# EasyEDA schematic PHOTOPOLYMER_CURE_LIGHT_V0_0.json
TITLE: Sheet_1; REV: 1.0; Date: 2023-11-01; Sheet: 1/1; Drawn By: AmirB; Company: Your Company
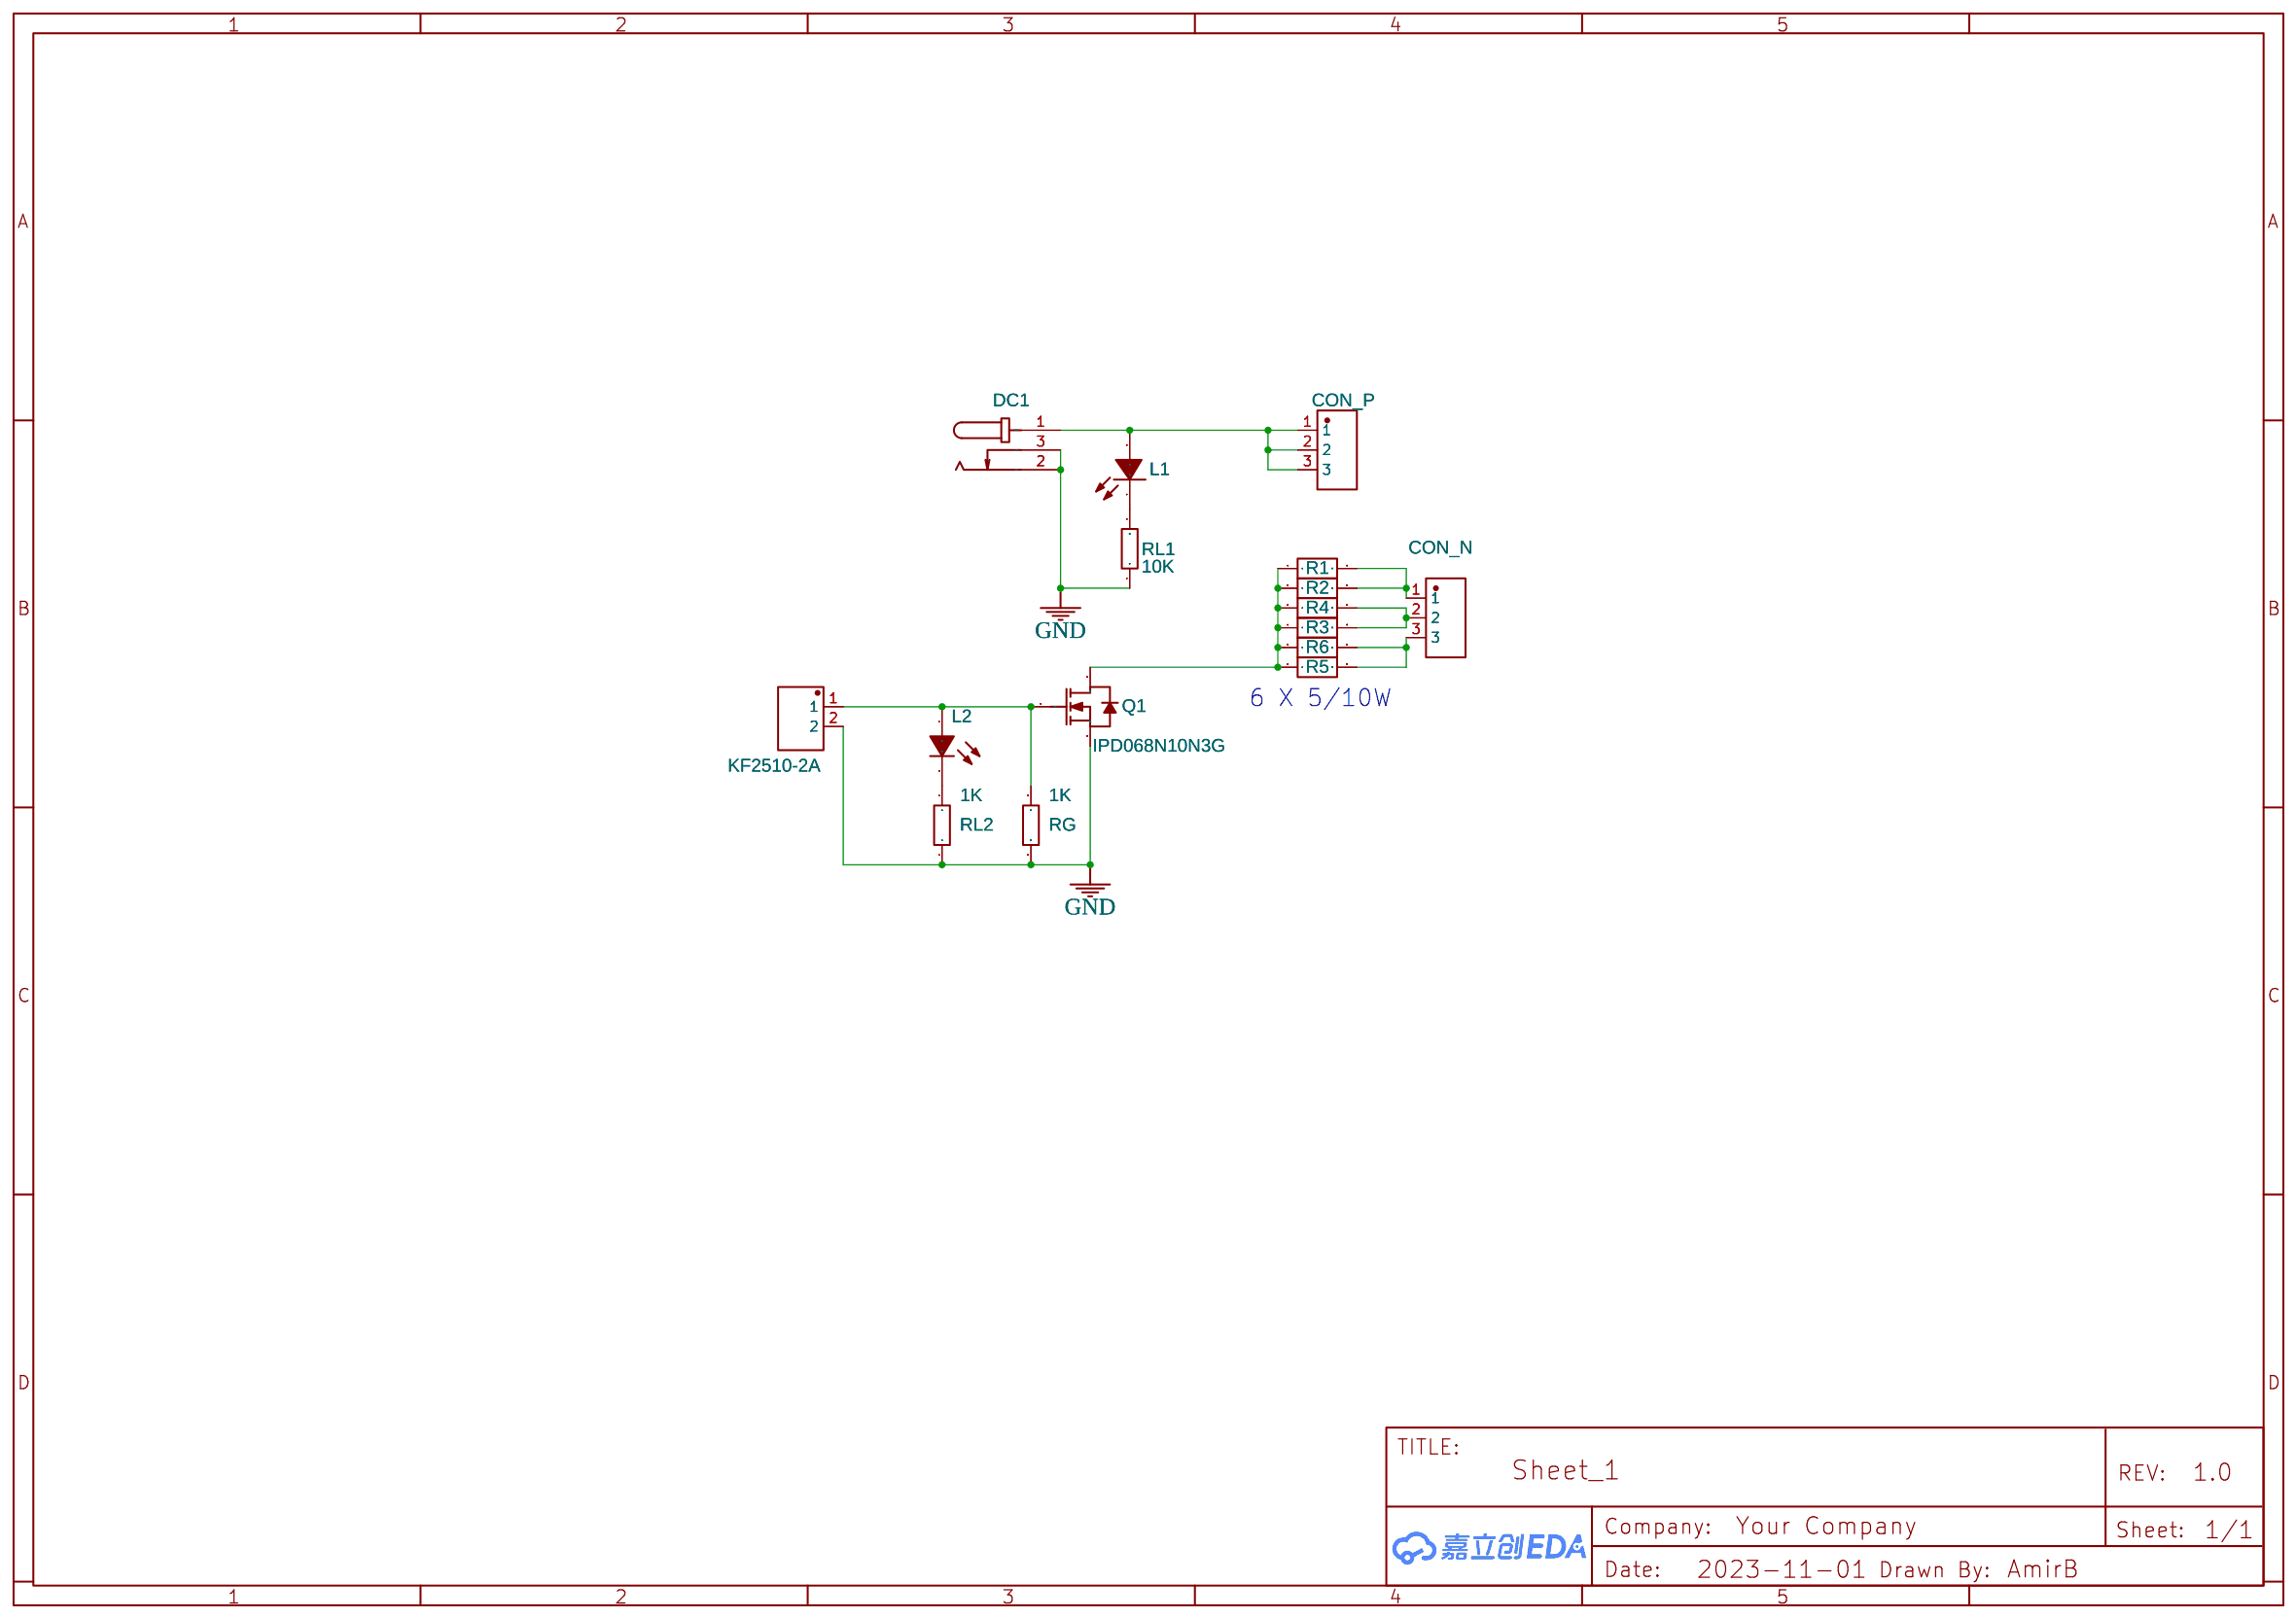
[diagram p0: schematic sheet]

## Parts
CON_N  DB126V-5.0-3P  [CONN-TH_3P-P5.00_DB126V-5.0-3P]
CON_P  DB126V-5.0-3P  [CONN-TH_3P-P5.00_DB126V-5.0-3P]
DC1  DC  [DC-IN-TH_DC005]
L1  KT-0603R  [LED0603-RD]
L2  LED  [LED0603-R-RD_BLUE]
Q1  IPD068N10N3G  [TO-252-3_L6.5-W5.8-P4.58-BL]
R1  B12J20RE  [RES-TH_BD8.0-L44.5-P48.50-D1.0]
R2  B12J20RE  [RES-TH_BD8.0-L44.5-P48.50-D1.0]
R3  B12J20RE  [RES-TH_BD8.0-L44.5-P48.50-D1.0]
R4  B12J20RE  [RES-TH_BD8.0-L44.5-P48.50-D1.0]
R5  B12J20RE  [RES-TH_BD8.0-L44.5-P48.50-D1.0]
R6  B12J20RE  [RES-TH_BD8.0-L44.5-P48.50-D1.0]
RG  1K  [R0603]
RL1  10K  [R0603]
RL2  1K  [R0603]
VIN1  KF2510-2A  [CONN-TH_KF2510-2A]

## Library data of the parts
CON_N CON_P = DB126V-5.0-3P: Contributor: LCSC; Supplier: LCSC; Supplier Part: C395850; Manufacturer: DIBO(地博电气); JLCPCB Part Class: Extended Part; Package Display: No
DC1 = DC005-2.0MM: Supplier: LCSC; Manufacturer: SOFNG; Supplier Part: C111567; Package Display: No
L1 = KT-0603R: Supplier: LCSC; Manufacturer: KENTO; Supplier Part: C2286; JLCPCB Part Class: Basic Part; Package Display: No
L2 = 19-217/BHC-ZL1M2RY/3T: Supplier: LCSC; Manufacturer: EVERLIGHT; Supplier Part: C72041; JLCPCB Part Class: Basic Part; Package Display: No
Q1 = IPD068N10N3G: Supplier: LCSC; Manufacturer: Infineon(英飞凌); Supplier Part: C88066; JLCPCB Part Class: Extended Part; Package Display: No
R1-R6 = B12J20RE: Contributor: LCSC; Supplier: LCSC; Supplier Part: C2642179; Manufacturer: Ohmite; Package Display: No
RG RL2 = 0603WAF1001T5E: Supplier: LCSC; Manufacturer: UniOhm; Supplier Part: C21190; JLCPCB Part Class: Basic Part; Package Display: No
RL1 = 0603WAF1001T5E: Supplier: LCSC; Manufacturer: UniOhm; Manufacturer Part: 0603WAF1002T5E; Supplier Part: C25804; JLCPCB Part Class: Basic Part; Package Display: No
VIN1 = KF2510-2A: Supplier: LCSC; Manufacturer: BOOMELE; Supplier Part: C27543; JLCPCB Part Class: Extended Part; Package Display: No

## Nets
GND: DC1.2 DC1.3 Q1.3(S) RG.1 RL1.1 RL2.1 VIN1.2
Net-(CON_N-1): CON_N.1 R1.2 R2.2
Net-(CON_N-2): CON_N.2 R3.2 R4.2
Net-(CON_N-3): CON_N.3 R5.2 R6.2
Net-(CON_P-1): CON_P.1 CON_P.2 CON_P.3 DC1.1 L1.2(A)
Net-(L1-1): L1.1(K) RL1.2
Net-(L2-1): L2.1(A) Q1.1(G) RG.2 VIN1.1
Net-(L2-2): L2.2(C) RL2.2
Net-(Q1-2): Q1.2(D) R1.1 R2.1 R3.1 R4.1 R5.1 R6.1

## Notes on the sheet
- 6 X 5/10W
